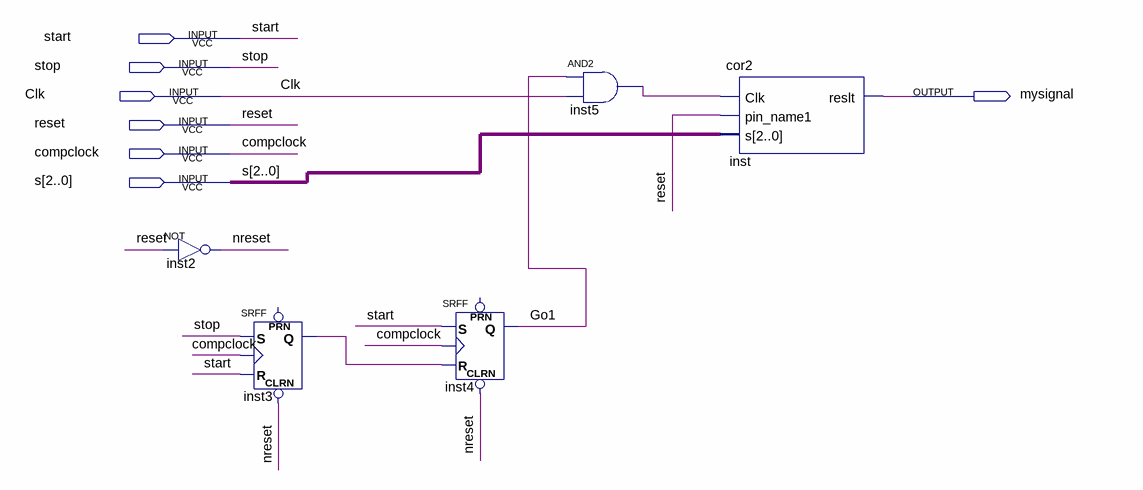
[diagram p0: schematic sheet]
// Quartus schematic gen.bdf as structural Verilog: 5 symbols, 7 pins
module gen (
  input  start,
  input  stop,
  input  Clk,
  input  reset,
  input  compclock,
  input  [2:0] s,
  output mysignal
);

  wire Go1, inst3_q, inst5_out, nreset;

  not inst2 (nreset, reset);
  SRFF inst3 (.CLRN(nreset), .S(stop), .R(start), .CLK(compclock), .Q(inst3_q));  // open: PRN
  SRFF inst4 (.CLRN(nreset), .S(start), .R(inst3_q), .CLK(compclock), .Q(Go1));  // open: PRN
  and inst5 (inst5_out, Go1, Clk);
  cor2 inst (.Clk(inst5_out), .pin_name1(reset), .s(s), .reslt(mysignal));
endmodule
